# Altium schematic sheet 4_Amplifier.SchDoc
size A; SheetNumber: 5; SheetTotal: 4
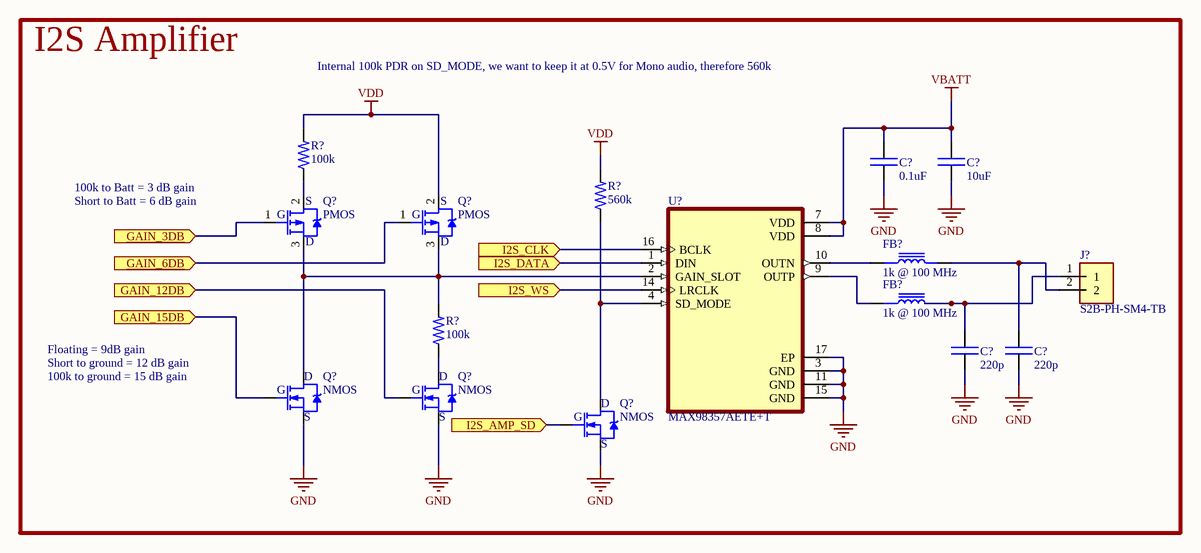
[diagram p0: 4_Amplifier.SchDoc]

## Parts
(Parts that share a designator on the sheet are numbered #1, #2 ... from top to bottom, then left to right.)
C?#1  value 10uF  [0402C]  (hidden comment: CAP)
C?#2  value 0.1uF  [0402C]  (hidden comment: CAP)
C?#3  value 220p  [0402C]  (hidden comment: CAP)
C?#4  value 220p  [0402C]  (hidden comment: CAP)
FB?#1  1k @ 100 MHz
FB?#2  1k @ 100 MHz
J?  S2B-PH-SM4-TB  [JST_PH-2POS-SMT-RA]
Q?#1  PMOS  [SOT-23]
Q?#2  PMOS  [SOT-23]
Q?#3  NMOS
Q?#4  NMOS
Q?#5  NMOS
R?#1  value 100k  [0402R]  (hidden comment: RES)
R?#2  value 560k  [0402R]  (hidden comment: RES)
R?#3  value 100k  [0402R]  (hidden comment: RES)
U?  MAX98357AETE+T  [16-WFQFN EXPOSED PAD]

## Ports
GAIN_3DB (in), GAIN_6DB (in), GAIN_12DB (in), GAIN_15DB (in), I2S_AMP_SD (in), I2S_CLK (in), I2S_DATA (in), I2S_WS (in)

## Nets
GND: C?#1.1 C?#2.2 C?#3.1 C?#4.1 Q?#3.2(S) Q?#4.2(S) Q?#5.2(S) U?.3(GND) U?.11(GND) U?.15(GND) U?.17(EP)
VBATT: C?#1.2 C?#2.1 U?.7(VDD) U?.8(VDD)
VDD: Q?#2.2(D) R?#1.2 R?#2.2
GAIN_3DB: Q?#1.1(G) ; port GAIN_3DB
GAIN_6DB: Q?#2.1(G) ; port GAIN_6DB
GAIN_12DB: Q?#4.1(G) ; port GAIN_12DB
GAIN_15DB: Q?#3.1(G) ; port GAIN_15DB
I2S_AMP_SD: Q?#5.1(G) ; port I2S_AMP_SD
I2S_CLK: U?.16(BCLK) ; port I2S_CLK
I2S_DATA: U?.1(DIN) ; port I2S_DATA
I2S_WS: U?.14(LRCLK) ; port I2S_WS
NetC?#3_2: C?#3.2 FB?#2.2 J?.1
NetC?#4_2: C?#4.2 FB?#1.2 J?.2
NetFB?#1_1: FB?#1.1 U?.10(OUTN)
NetFB?#2_1: FB?#2.1 U?.9(OUTP)
NetQ?#1_2: Q?#1.2(D) R?#1.1
NetQ?#1_3: Q?#1.3(S) Q?#2.3(S) Q?#3.3(D) R?#3.2 U?.2(GAIN_SLOT)
NetQ?#4_3: Q?#4.3(D) R?#3.1
NetQ?#5_3: Q?#5.3(D) R?#2.1 U?.4(SD_MODE)

## Notes on the sheet
- I2S Amplifier
- Internal 100k PDR on SD_MODE, we want to keep it at 0.5V for Mono audio, therefore 560k
- 100k to Batt = 3 dB gain
- (near Q?#1) Short to Batt = 6 dB gain
- 100k to ground = 15 dB gain
- Short to ground = 12 dB gain
- Floating = 9dB gain

## Library data of the parts
C?#1-C?#4 = CAP: Capacitor; MFR: *; MFR PN: *; JLCPCB PN: *; Footprint: *
FB?#1 FB?#2 = FERRITE BEAD: MFR: TDK; MFR PN: MMZ1608Y102BTD25; Value: *; JLCPCB PN: *; Footprint: *
J? = JST CONN 2POS PH: Connector Header Surface Mount, Right Angle 2 position 0.079 (2.00mm); MFR PN: S2B-PH-SM4-TB(TF)(SN); MFR: JST Sales; Value: S2B-PH-SM4-TB(TF)(SN); Type: SMD
Q?#1 Q?#2 = PMOS: P-Channel MOSFET; MFR: Diodes Incorporated; Value: BSS84-7-F; Footprint: *; JLCPCB PN: *
Q?#3-Q?#5 = NMOS: N-Channel MOSFET; MFR: Diodes Incorporated; Value: DMN63D8L; Type: SMD; Footprint: *; JLCPCB PN: *
R?#1-R?#3 = RES: Resistor; MFR PN: *; MFR: *; JLCPCB PN: *
U? = MAX98357AETE+T: I2S Audio DAC and amp; MFR: Analog Devices; Value: MAX98357AETE+T; Type: SMD; Footprint: *